# EAGLE schematic Maker Display2 (EAGLE 7.3.0)

## Sheet 1 of 5: Matrix Driver 1
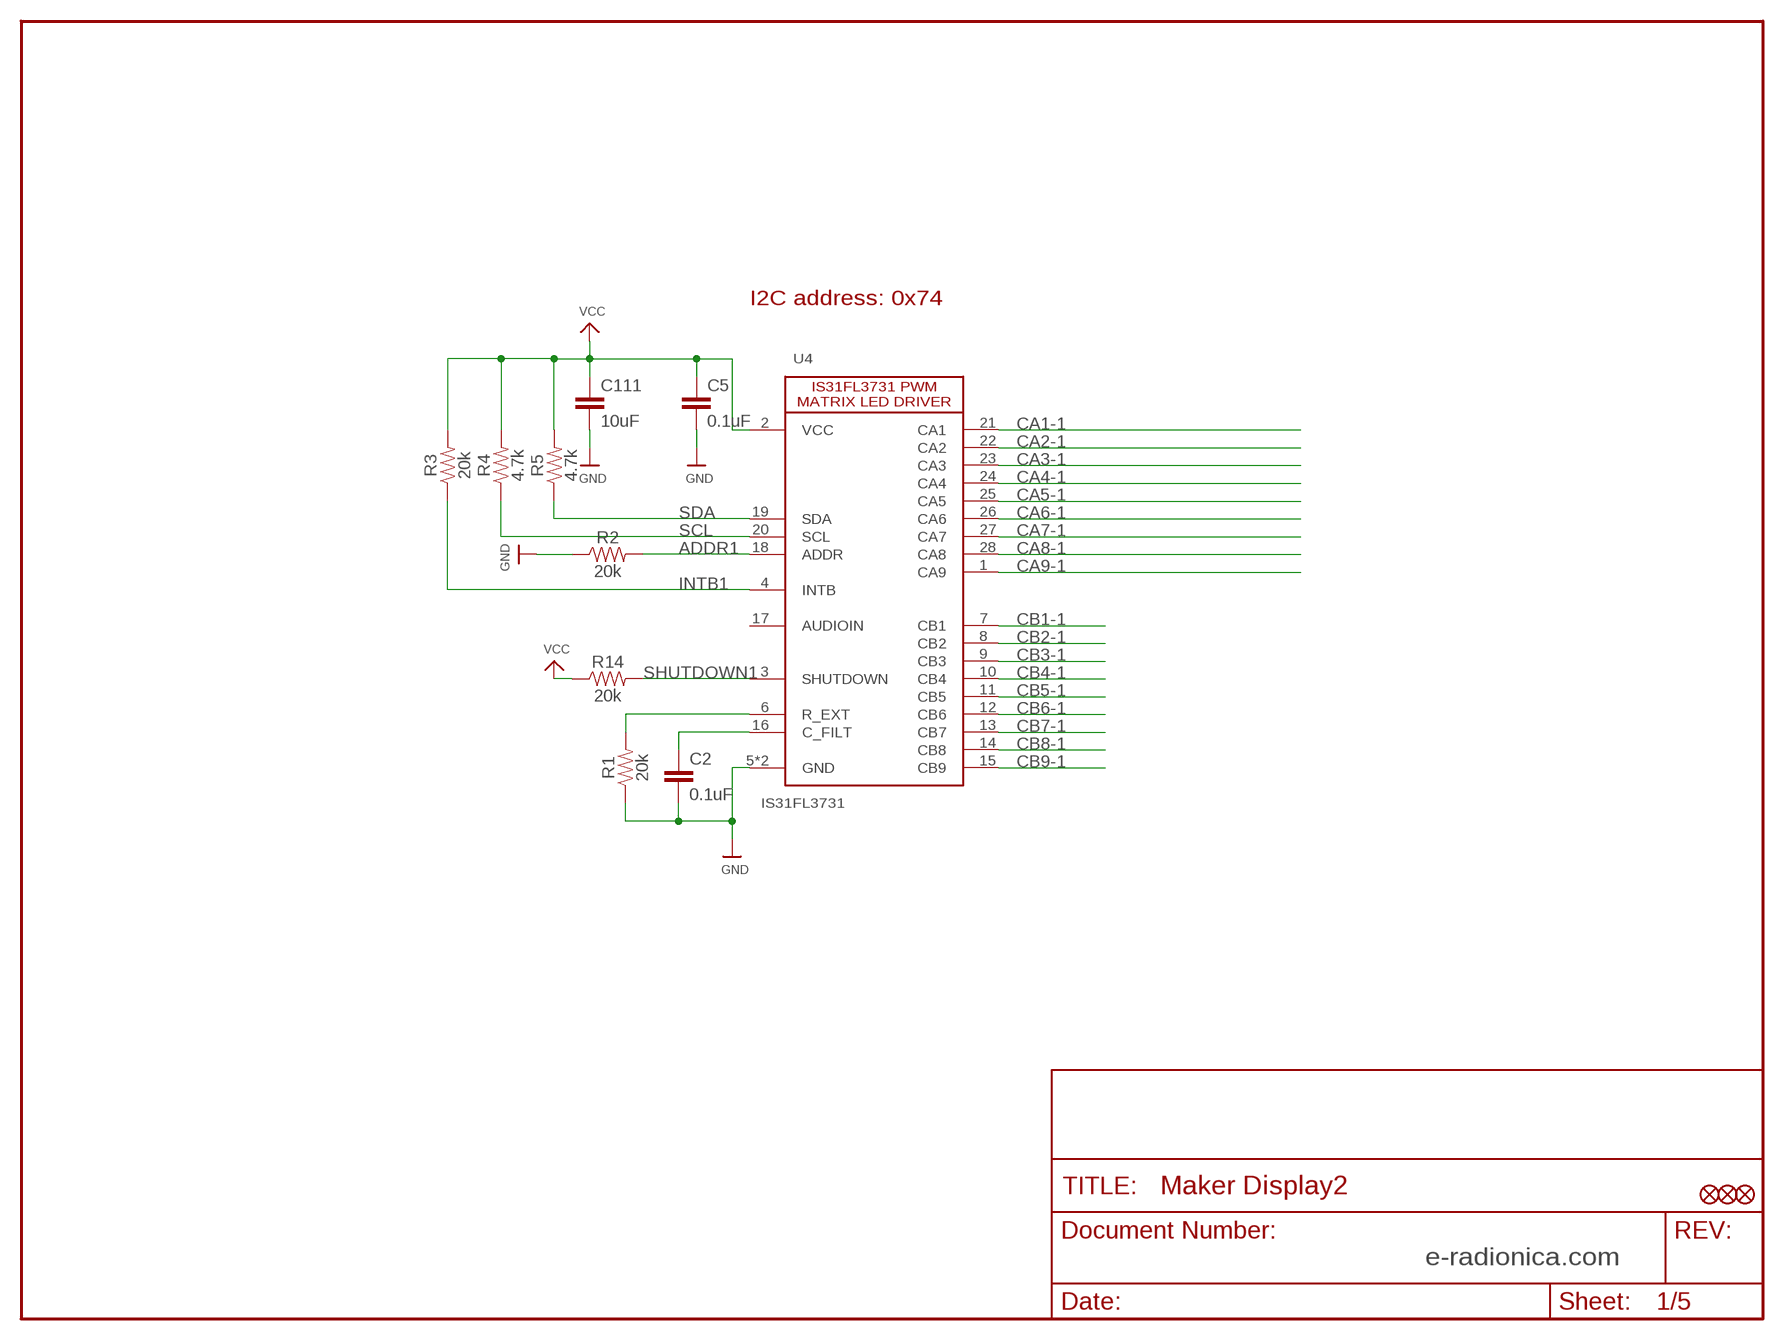
[diagram p0: schematic, sheet 1]

### Parts
C2  0.1uF  0.1UF-0603-25V-(+80/-20%)  [0603]
C5  0.1uF  0.1UF-0603-25V-(+80/-20%)  [0603]
C111  10uF  10UF-1206-6.3V-20%  [1206]
JP2  FIDUCIAL1X2  [FIDUCIAL-1X2]
JP3  FIDUCIAL1X2  [FIDUCIAL-1X2]
JP4  FIDUCIAL1X2  [FIDUCIAL-1X2]
R1  20k  20KOHM-0603-1/10W-1%  [0603]
R2  20k  20KOHM-0603-1/10W-1%  [0603]
R3  20k  20KOHM-0603-1/10W-1%  [0603]
R4  4.7k  4.7KOHM-0603-1/10W-1%  [0603]
R5  4.7k  4.7KOHM-0603-1/10W-1%  [0603]
R14  20k  20KOHM-0603-1/10W-1%  [0603]
U4  IS31FL3731  [QFN28]

### Nets
ADDR1: R2.2 U4.18(ADDR)
C-FILT: C2.1 U4.16(C_FILT)
CA1-1: U4.21(CA1) ; also sheet 2
CA2-1: U4.22(CA2) ; also sheet 2
CA3-1: U4.23(CA3) ; also sheet 2
CA4-1: U4.24(CA4) ; also sheet 2
CA5-1: U4.25(CA5) ; also sheet 2
CA6-1: U4.26(CA6) ; also sheet 2
CA7-1: U4.27(CA7) ; also sheet 2
CA8-1: U4.28(CA8) ; also sheet 2
CA9-1: U4.1(CA9) ; also sheet 2
CB1-1: U4.7(CB1) ; also sheet 2
CB2-1: U4.8(CB2) ; also sheet 2
CB3-1: U4.9(CB3) ; also sheet 2
CB4-1: U4.10(CB4) ; also sheet 2
CB5-1: U4.11(CB5) ; also sheet 2
CB6-1: U4.12(CB6) ; also sheet 2
CB7-1: U4.13(CB7) ; also sheet 2
CB8-1: U4.14(CB8) ; also sheet 2
CB9-1: U4.15(CB9) ; also sheet 2
GND: C2.2 C5.2 C111.2 R1.1 R2.1 U4.5(GND) U4.29_GND(GND) ; also sheet 3,5
INTB1: R3.1 U4.4(INTB)
R-EXT: R1.2 U4.6(R_EXT)
SCL: R4.1 U4.20(SCL) ; also sheet 3,5
SDA: R5.1 U4.19(SDA) ; also sheet 3,5
SHUTDOWN1: R14.2 U4.3(SHUTDOWN)
VCC: C5.1 C111.1 R3.2 R4.2 R5.2 R14.1 U4.2(VCC) ; also sheet 3,5
Unconnected: U4.17(AUDIOIN)

### Notes on the sheet
- I2C address: 0x74
- e-radionica.com

## Sheet 2 of 5: LED matrix 1
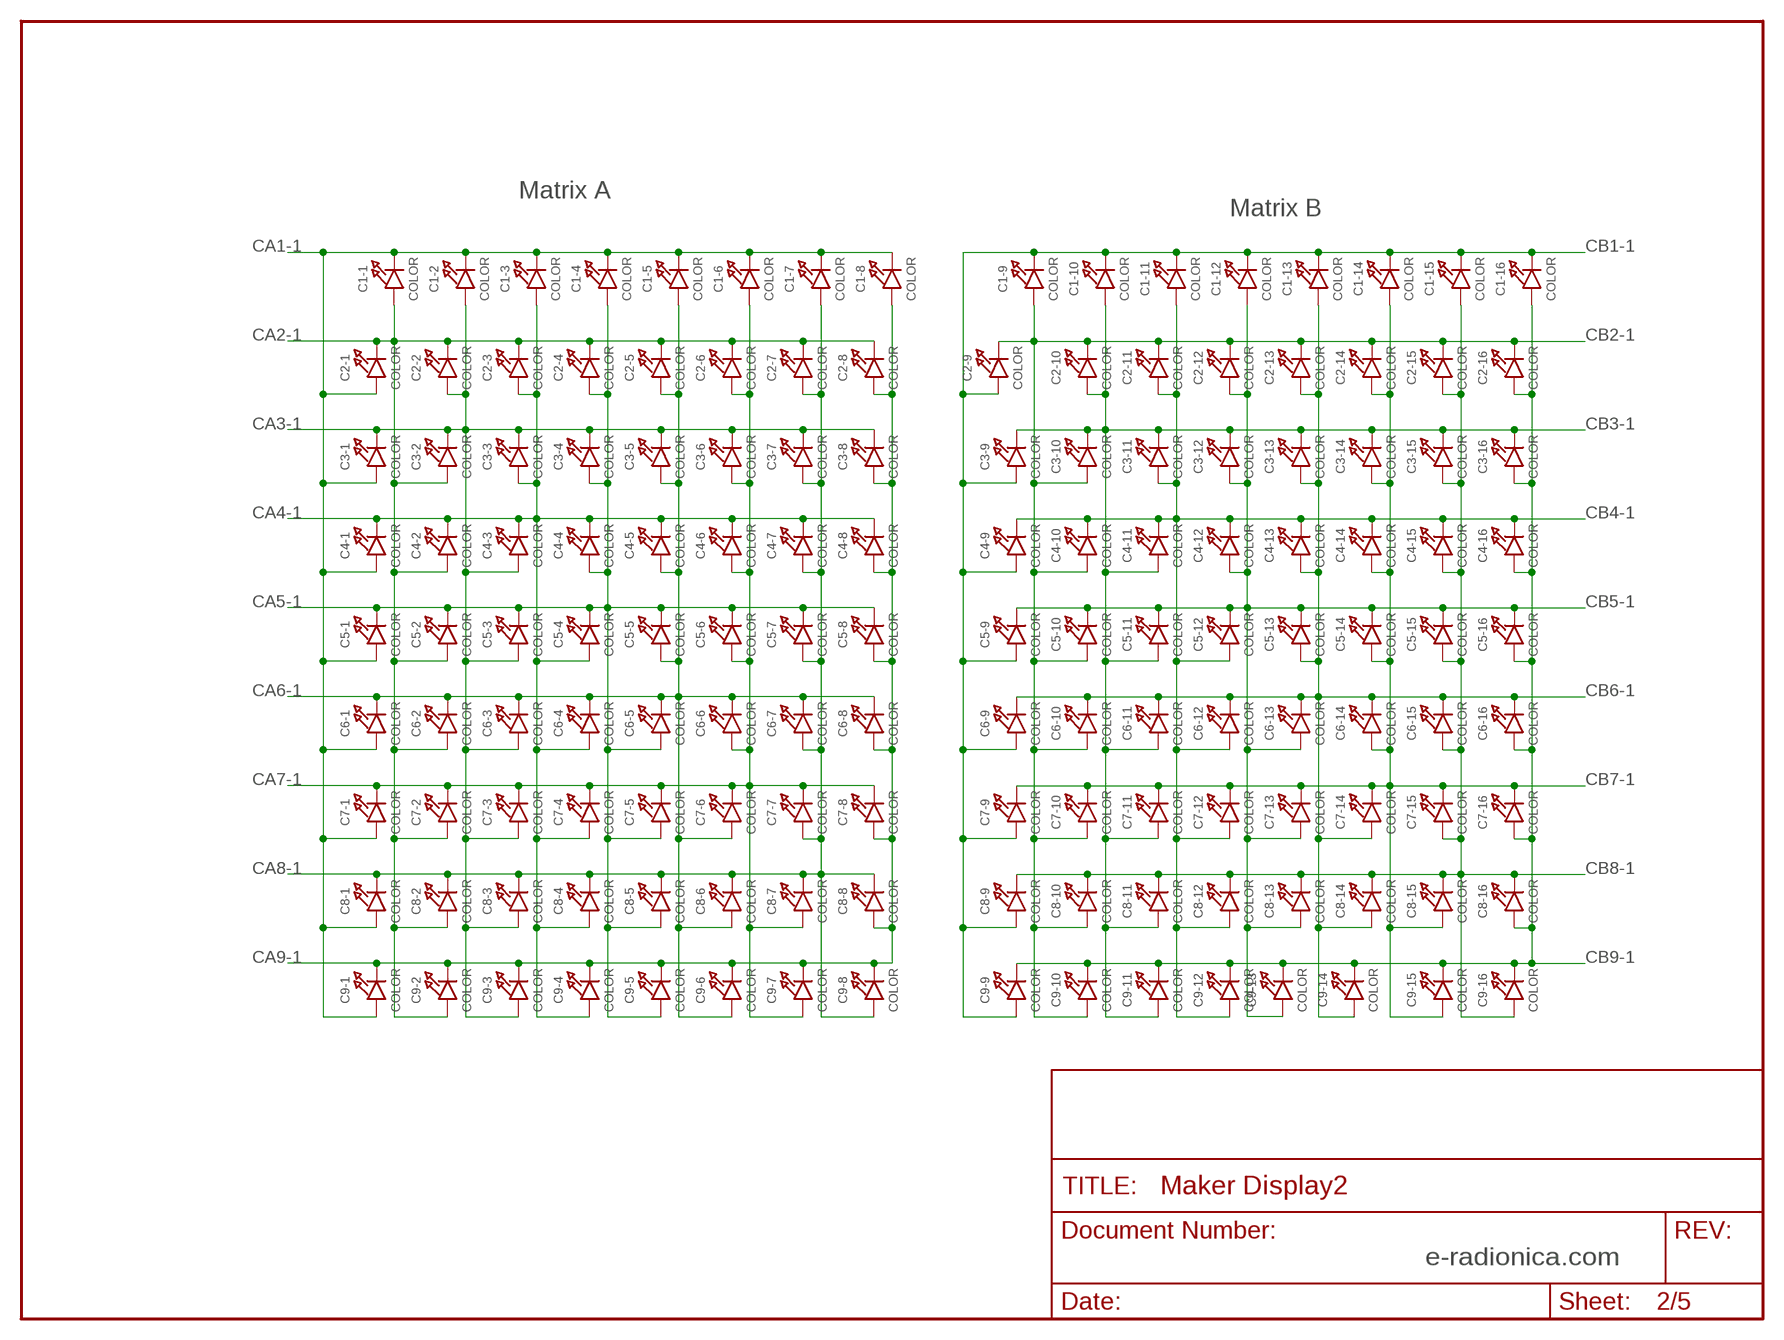
[diagram p1: schematic, sheet 2]

### Parts
C1-1  COLOR  LED0603_NOOUTLINE  [CHIPLED_0603_NOOUTLINE]
C1-2  COLOR  LED0603_NOOUTLINE  [CHIPLED_0603_NOOUTLINE]
C1-3  COLOR  LED0603_NOOUTLINE  [CHIPLED_0603_NOOUTLINE]
C1-4  COLOR  LED0603_NOOUTLINE  [CHIPLED_0603_NOOUTLINE]
C1-5  COLOR  LED0603_NOOUTLINE  [CHIPLED_0603_NOOUTLINE]
C1-6  COLOR  LED0603_NOOUTLINE  [CHIPLED_0603_NOOUTLINE]
C1-7  COLOR  LED0603_NOOUTLINE  [CHIPLED_0603_NOOUTLINE]
C1-8  COLOR  LED0603_NOOUTLINE  [CHIPLED_0603_NOOUTLINE]
C1-9  COLOR  LED0603_NOOUTLINE  [CHIPLED_0603_NOOUTLINE]
C1-10  COLOR  LED0603_NOOUTLINE  [CHIPLED_0603_NOOUTLINE]
C1-11  COLOR  LED0603_NOOUTLINE  [CHIPLED_0603_NOOUTLINE]
C1-12  COLOR  LED0603_NOOUTLINE  [CHIPLED_0603_NOOUTLINE]
C1-13  COLOR  LED0603_NOOUTLINE  [CHIPLED_0603_NOOUTLINE]
C1-14  COLOR  LED0603_NOOUTLINE  [CHIPLED_0603_NOOUTLINE]
C1-15  COLOR  LED0603_NOOUTLINE  [CHIPLED_0603_NOOUTLINE]
C1-16  COLOR  LED0603_NOOUTLINE  [CHIPLED_0603_NOOUTLINE]
C2-1  COLOR  LED0603_NOOUTLINE  [CHIPLED_0603_NOOUTLINE]
C2-2  COLOR  LED0603_NOOUTLINE  [CHIPLED_0603_NOOUTLINE]
C2-3  COLOR  LED0603_NOOUTLINE  [CHIPLED_0603_NOOUTLINE]
C2-4  COLOR  LED0603_NOOUTLINE  [CHIPLED_0603_NOOUTLINE]
C2-5  COLOR  LED0603_NOOUTLINE  [CHIPLED_0603_NOOUTLINE]
C2-6  COLOR  LED0603_NOOUTLINE  [CHIPLED_0603_NOOUTLINE]
C2-7  COLOR  LED0603_NOOUTLINE  [CHIPLED_0603_NOOUTLINE]
C2-8  COLOR  LED0603_NOOUTLINE  [CHIPLED_0603_NOOUTLINE]
C2-9  COLOR  LED0603_NOOUTLINE  [CHIPLED_0603_NOOUTLINE]
C2-10  COLOR  LED0603_NOOUTLINE  [CHIPLED_0603_NOOUTLINE]
C2-11  COLOR  LED0603_NOOUTLINE  [CHIPLED_0603_NOOUTLINE]
C2-12  COLOR  LED0603_NOOUTLINE  [CHIPLED_0603_NOOUTLINE]
C2-13  COLOR  LED0603_NOOUTLINE  [CHIPLED_0603_NOOUTLINE]
C2-14  COLOR  LED0603_NOOUTLINE  [CHIPLED_0603_NOOUTLINE]
C2-15  COLOR  LED0603_NOOUTLINE  [CHIPLED_0603_NOOUTLINE]
C2-16  COLOR  LED0603_NOOUTLINE  [CHIPLED_0603_NOOUTLINE]
C3-1  COLOR  LED0603_NOOUTLINE  [CHIPLED_0603_NOOUTLINE]
C3-2  COLOR  LED0603_NOOUTLINE  [CHIPLED_0603_NOOUTLINE]
C3-3  COLOR  LED0603_NOOUTLINE  [CHIPLED_0603_NOOUTLINE]
C3-4  COLOR  LED0603_NOOUTLINE  [CHIPLED_0603_NOOUTLINE]
C3-5  COLOR  LED0603_NOOUTLINE  [CHIPLED_0603_NOOUTLINE]
C3-6  COLOR  LED0603_NOOUTLINE  [CHIPLED_0603_NOOUTLINE]
C3-7  COLOR  LED0603_NOOUTLINE  [CHIPLED_0603_NOOUTLINE]
C3-8  COLOR  LED0603_NOOUTLINE  [CHIPLED_0603_NOOUTLINE]
C3-9  COLOR  LED0603_NOOUTLINE  [CHIPLED_0603_NOOUTLINE]
C3-10  COLOR  LED0603_NOOUTLINE  [CHIPLED_0603_NOOUTLINE]
C3-11  COLOR  LED0603_NOOUTLINE  [CHIPLED_0603_NOOUTLINE]
C3-12  COLOR  LED0603_NOOUTLINE  [CHIPLED_0603_NOOUTLINE]
C3-13  COLOR  LED0603_NOOUTLINE  [CHIPLED_0603_NOOUTLINE]
C3-14  COLOR  LED0603_NOOUTLINE  [CHIPLED_0603_NOOUTLINE]
C3-15  COLOR  LED0603_NOOUTLINE  [CHIPLED_0603_NOOUTLINE]
C3-16  COLOR  LED0603_NOOUTLINE  [CHIPLED_0603_NOOUTLINE]
C4-1  COLOR  LED0603_NOOUTLINE  [CHIPLED_0603_NOOUTLINE]
C4-2  COLOR  LED0603_NOOUTLINE  [CHIPLED_0603_NOOUTLINE]
C4-3  COLOR  LED0603_NOOUTLINE  [CHIPLED_0603_NOOUTLINE]
C4-4  COLOR  LED0603_NOOUTLINE  [CHIPLED_0603_NOOUTLINE]
C4-5  COLOR  LED0603_NOOUTLINE  [CHIPLED_0603_NOOUTLINE]
C4-6  COLOR  LED0603_NOOUTLINE  [CHIPLED_0603_NOOUTLINE]
C4-7  COLOR  LED0603_NOOUTLINE  [CHIPLED_0603_NOOUTLINE]
C4-8  COLOR  LED0603_NOOUTLINE  [CHIPLED_0603_NOOUTLINE]
C4-9  COLOR  LED0603_NOOUTLINE  [CHIPLED_0603_NOOUTLINE]
C4-10  COLOR  LED0603_NOOUTLINE  [CHIPLED_0603_NOOUTLINE]
C4-11  COLOR  LED0603_NOOUTLINE  [CHIPLED_0603_NOOUTLINE]
C4-12  COLOR  LED0603_NOOUTLINE  [CHIPLED_0603_NOOUTLINE]
C4-13  COLOR  LED0603_NOOUTLINE  [CHIPLED_0603_NOOUTLINE]
C4-14  COLOR  LED0603_NOOUTLINE  [CHIPLED_0603_NOOUTLINE]
C4-15  COLOR  LED0603_NOOUTLINE  [CHIPLED_0603_NOOUTLINE]
C4-16  COLOR  LED0603_NOOUTLINE  [CHIPLED_0603_NOOUTLINE]
C5-1  COLOR  LED0603_NOOUTLINE  [CHIPLED_0603_NOOUTLINE]
C5-2  COLOR  LED0603_NOOUTLINE  [CHIPLED_0603_NOOUTLINE]
C5-3  COLOR  LED0603_NOOUTLINE  [CHIPLED_0603_NOOUTLINE]
C5-4  COLOR  LED0603_NOOUTLINE  [CHIPLED_0603_NOOUTLINE]
C5-5  COLOR  LED0603_NOOUTLINE  [CHIPLED_0603_NOOUTLINE]
C5-6  COLOR  LED0603_NOOUTLINE  [CHIPLED_0603_NOOUTLINE]
C5-7  COLOR  LED0603_NOOUTLINE  [CHIPLED_0603_NOOUTLINE]
C5-8  COLOR  LED0603_NOOUTLINE  [CHIPLED_0603_NOOUTLINE]
C5-9  COLOR  LED0603_NOOUTLINE  [CHIPLED_0603_NOOUTLINE]
C5-10  COLOR  LED0603_NOOUTLINE  [CHIPLED_0603_NOOUTLINE]
C5-11  COLOR  LED0603_NOOUTLINE  [CHIPLED_0603_NOOUTLINE]
C5-12  COLOR  LED0603_NOOUTLINE  [CHIPLED_0603_NOOUTLINE]
C5-13  COLOR  LED0603_NOOUTLINE  [CHIPLED_0603_NOOUTLINE]
C5-14  COLOR  LED0603_NOOUTLINE  [CHIPLED_0603_NOOUTLINE]
C5-15  COLOR  LED0603_NOOUTLINE  [CHIPLED_0603_NOOUTLINE]
C5-16  COLOR  LED0603_NOOUTLINE  [CHIPLED_0603_NOOUTLINE]
C6-1  COLOR  LED0603_NOOUTLINE  [CHIPLED_0603_NOOUTLINE]
C6-2  COLOR  LED0603_NOOUTLINE  [CHIPLED_0603_NOOUTLINE]
C6-3  COLOR  LED0603_NOOUTLINE  [CHIPLED_0603_NOOUTLINE]
C6-4  COLOR  LED0603_NOOUTLINE  [CHIPLED_0603_NOOUTLINE]
C6-5  COLOR  LED0603_NOOUTLINE  [CHIPLED_0603_NOOUTLINE]
C6-6  COLOR  LED0603_NOOUTLINE  [CHIPLED_0603_NOOUTLINE]
C6-7  COLOR  LED0603_NOOUTLINE  [CHIPLED_0603_NOOUTLINE]
C6-8  COLOR  LED0603_NOOUTLINE  [CHIPLED_0603_NOOUTLINE]
C6-9  COLOR  LED0603_NOOUTLINE  [CHIPLED_0603_NOOUTLINE]
C6-10  COLOR  LED0603_NOOUTLINE  [CHIPLED_0603_NOOUTLINE]
C6-11  COLOR  LED0603_NOOUTLINE  [CHIPLED_0603_NOOUTLINE]
C6-12  COLOR  LED0603_NOOUTLINE  [CHIPLED_0603_NOOUTLINE]
C6-13  COLOR  LED0603_NOOUTLINE  [CHIPLED_0603_NOOUTLINE]
C6-14  COLOR  LED0603_NOOUTLINE  [CHIPLED_0603_NOOUTLINE]
C6-15  COLOR  LED0603_NOOUTLINE  [CHIPLED_0603_NOOUTLINE]
C6-16  COLOR  LED0603_NOOUTLINE  [CHIPLED_0603_NOOUTLINE]
C7-1  COLOR  LED0603_NOOUTLINE  [CHIPLED_0603_NOOUTLINE]
C7-2  COLOR  LED0603_NOOUTLINE  [CHIPLED_0603_NOOUTLINE]
C7-3  COLOR  LED0603_NOOUTLINE  [CHIPLED_0603_NOOUTLINE]
C7-4  COLOR  LED0603_NOOUTLINE  [CHIPLED_0603_NOOUTLINE]
C7-5  COLOR  LED0603_NOOUTLINE  [CHIPLED_0603_NOOUTLINE]
C7-6  COLOR  LED0603_NOOUTLINE  [CHIPLED_0603_NOOUTLINE]
C7-7  COLOR  LED0603_NOOUTLINE  [CHIPLED_0603_NOOUTLINE]
C7-8  COLOR  LED0603_NOOUTLINE  [CHIPLED_0603_NOOUTLINE]
C7-9  COLOR  LED0603_NOOUTLINE  [CHIPLED_0603_NOOUTLINE]
C7-10  COLOR  LED0603_NOOUTLINE  [CHIPLED_0603_NOOUTLINE]
C7-11  COLOR  LED0603_NOOUTLINE  [CHIPLED_0603_NOOUTLINE]
C7-12  COLOR  LED0603_NOOUTLINE  [CHIPLED_0603_NOOUTLINE]
C7-13  COLOR  LED0603_NOOUTLINE  [CHIPLED_0603_NOOUTLINE]
C7-14  COLOR  LED0603_NOOUTLINE  [CHIPLED_0603_NOOUTLINE]
C7-15  COLOR  LED0603_NOOUTLINE  [CHIPLED_0603_NOOUTLINE]
C7-16  COLOR  LED0603_NOOUTLINE  [CHIPLED_0603_NOOUTLINE]
C8-1  COLOR  LED0603_NOOUTLINE  [CHIPLED_0603_NOOUTLINE]
C8-2  COLOR  LED0603_NOOUTLINE  [CHIPLED_0603_NOOUTLINE]
C8-3  COLOR  LED0603_NOOUTLINE  [CHIPLED_0603_NOOUTLINE]
C8-4  COLOR  LED0603_NOOUTLINE  [CHIPLED_0603_NOOUTLINE]
C8-5  COLOR  LED0603_NOOUTLINE  [CHIPLED_0603_NOOUTLINE]
C8-6  COLOR  LED0603_NOOUTLINE  [CHIPLED_0603_NOOUTLINE]
C8-7  COLOR  LED0603_NOOUTLINE  [CHIPLED_0603_NOOUTLINE]
C8-8  COLOR  LED0603_NOOUTLINE  [CHIPLED_0603_NOOUTLINE]
C8-9  COLOR  LED0603_NOOUTLINE  [CHIPLED_0603_NOOUTLINE]
C8-10  COLOR  LED0603_NOOUTLINE  [CHIPLED_0603_NOOUTLINE]
C8-11  COLOR  LED0603_NOOUTLINE  [CHIPLED_0603_NOOUTLINE]
C8-12  COLOR  LED0603_NOOUTLINE  [CHIPLED_0603_NOOUTLINE]
C8-13  COLOR  LED0603_NOOUTLINE  [CHIPLED_0603_NOOUTLINE]
C8-14  COLOR  LED0603_NOOUTLINE  [CHIPLED_0603_NOOUTLINE]
C8-15  COLOR  LED0603_NOOUTLINE  [CHIPLED_0603_NOOUTLINE]
C8-16  COLOR  LED0603_NOOUTLINE  [CHIPLED_0603_NOOUTLINE]
C9-1  COLOR  LED0603_NOOUTLINE  [CHIPLED_0603_NOOUTLINE]
C9-2  COLOR  LED0603_NOOUTLINE  [CHIPLED_0603_NOOUTLINE]
C9-3  COLOR  LED0603_NOOUTLINE  [CHIPLED_0603_NOOUTLINE]
C9-4  COLOR  LED0603_NOOUTLINE  [CHIPLED_0603_NOOUTLINE]
C9-5  COLOR  LED0603_NOOUTLINE  [CHIPLED_0603_NOOUTLINE]
C9-6  COLOR  LED0603_NOOUTLINE  [CHIPLED_0603_NOOUTLINE]
C9-7  COLOR  LED0603_NOOUTLINE  [CHIPLED_0603_NOOUTLINE]
C9-8  COLOR  LED0603_NOOUTLINE  [CHIPLED_0603_NOOUTLINE]
C9-9  COLOR  LED0603_NOOUTLINE  [CHIPLED_0603_NOOUTLINE]
C9-10  COLOR  LED0603_NOOUTLINE  [CHIPLED_0603_NOOUTLINE]
C9-11  COLOR  LED0603_NOOUTLINE  [CHIPLED_0603_NOOUTLINE]
C9-12  COLOR  LED0603_NOOUTLINE  [CHIPLED_0603_NOOUTLINE]
C9-13  COLOR  LED0603_NOOUTLINE  [CHIPLED_0603_NOOUTLINE]
C9-14  COLOR  LED0603_NOOUTLINE  [CHIPLED_0603_NOOUTLINE]
C9-15  COLOR  LED0603_NOOUTLINE  [CHIPLED_0603_NOOUTLINE]
C9-16  COLOR  LED0603_NOOUTLINE  [CHIPLED_0603_NOOUTLINE]

### Nets
CA1-1: C1-1.C C1-2.C C1-3.C C1-4.C C1-5.C C1-6.C C1-7.C C1-8.C C2-1.A C3-1.A C4-1.A C5-1.A C6-1.A C7-1.A C8-1.A C9-1.A ; also sheet 1
CA2-1: C1-1.A C2-1.C C2-2.C C2-3.C C2-4.C C2-5.C C2-6.C C2-7.C C2-8.C C3-2.A C4-2.A C5-2.A C6-2.A C7-2.A C8-2.A C9-2.A ; also sheet 1
CA3-1: C1-2.A C2-2.A C3-1.C C3-2.C C3-3.C C3-4.C C3-5.C C3-6.C C3-7.C C3-8.C C4-3.A C5-3.A C6-3.A C7-3.A C8-3.A C9-3.A ; also sheet 1
CA4-1: C1-3.A C2-3.A C3-3.A C4-1.C C4-2.C C4-3.C C4-4.C C4-5.C C4-6.C C4-7.C C4-8.C C5-4.A C6-4.A C7-4.A C8-4.A C9-4.A ; also sheet 1
CA5-1: C1-4.A C2-4.A C3-4.A C4-4.A C5-1.C C5-2.C C5-3.C C5-4.C C5-5.C C5-6.C C5-7.C C5-8.C C6-5.A C7-5.A C8-5.A C9-5.A ; also sheet 1
CA6-1: C1-5.A C2-5.A C3-5.A C4-5.A C5-5.A C6-1.C C6-2.C C6-3.C C6-4.C C6-5.C C6-6.C C6-7.C C6-8.C C7-6.A C8-6.A C9-6.A ; also sheet 1
CA7-1: C1-6.A C2-6.A C3-6.A C4-6.A C5-6.A C6-6.A C7-1.C C7-2.C C7-3.C C7-4.C C7-5.C C7-6.C C7-7.C C7-8.C C8-7.A C9-7.A ; also sheet 1
CA8-1: C1-7.A C2-7.A C3-7.A C4-7.A C5-7.A C6-7.A C7-7.A C8-1.C C8-2.C C8-3.C C8-4.C C8-5.C C8-6.C C8-7.C C8-8.C C9-8.A ; also sheet 1
CA9-1: C1-8.A C2-8.A C3-8.A C4-8.A C5-8.A C6-8.A C7-8.A C8-8.A C9-1.C C9-2.C C9-3.C C9-4.C C9-5.C C9-6.C C9-7.C C9-8.C ; also sheet 1
CB1-1: C1-9.C C1-10.C C1-11.C C1-12.C C1-13.C C1-14.C C1-15.C C1-16.C C2-9.A C3-9.A C4-9.A C5-9.A C6-9.A C7-9.A C8-9.A C9-9.A ; also sheet 1
CB2-1: C1-9.A C2-9.C C2-10.C C2-11.C C2-12.C C2-13.C C2-14.C C2-15.C C2-16.C C3-10.A C4-10.A C5-10.A C6-10.A C7-10.A C8-10.A C9-10.A ; also sheet 1
CB3-1: C1-10.A C2-10.A C3-9.C C3-10.C C3-11.C C3-12.C C3-13.C C3-14.C C3-15.C C3-16.C C4-11.A C5-11.A C6-11.A C7-11.A C8-11.A C9-11.A ; also sheet 1
CB4-1: C1-11.A C2-11.A C3-11.A C4-9.C C4-10.C C4-11.C C4-12.C C4-13.C C4-14.C C4-15.C C4-16.C C5-12.A C6-12.A C7-12.A C8-12.A C9-12.A ; also sheet 1
CB5-1: C1-12.A C2-12.A C3-12.A C4-12.A C5-9.C C5-10.C C5-11.C C5-12.C C5-13.C C5-14.C C5-15.C C5-16.C C6-13.A C7-13.A C8-13.A C9-13.A ; also sheet 1
CB6-1: C1-13.A C2-13.A C3-13.A C4-13.A C5-13.A C6-9.C C6-10.C C6-11.C C6-12.C C6-13.C C6-14.C C6-15.C C6-16.C C7-14.A C8-14.A C9-14.A ; also sheet 1
CB7-1: C1-14.A C2-14.A C3-14.A C4-14.A C5-14.A C6-14.A C7-9.C C7-10.C C7-11.C C7-12.C C7-13.C C7-14.C C7-15.C C7-16.C C8-15.A C9-15.A ; also sheet 1
CB8-1: C1-15.A C2-15.A C3-15.A C4-15.A C5-15.A C6-15.A C7-15.A C8-9.C C8-10.C C8-11.C C8-12.C C8-13.C C8-14.C C8-15.C C8-16.C C9-16.A ; also sheet 1
CB9-1: C1-16.A C2-16.A C3-16.A C4-16.A C5-16.A C6-16.A C7-16.A C8-16.A C9-9.C C9-10.C C9-11.C C9-12.C C9-13.C C9-14.C C9-15.C C9-16.C ; also sheet 1

### Notes on the sheet
- Matrix A
- Matrix B
- e-radionica.com

## Sheet 3 of 5: Matrix Driver 2
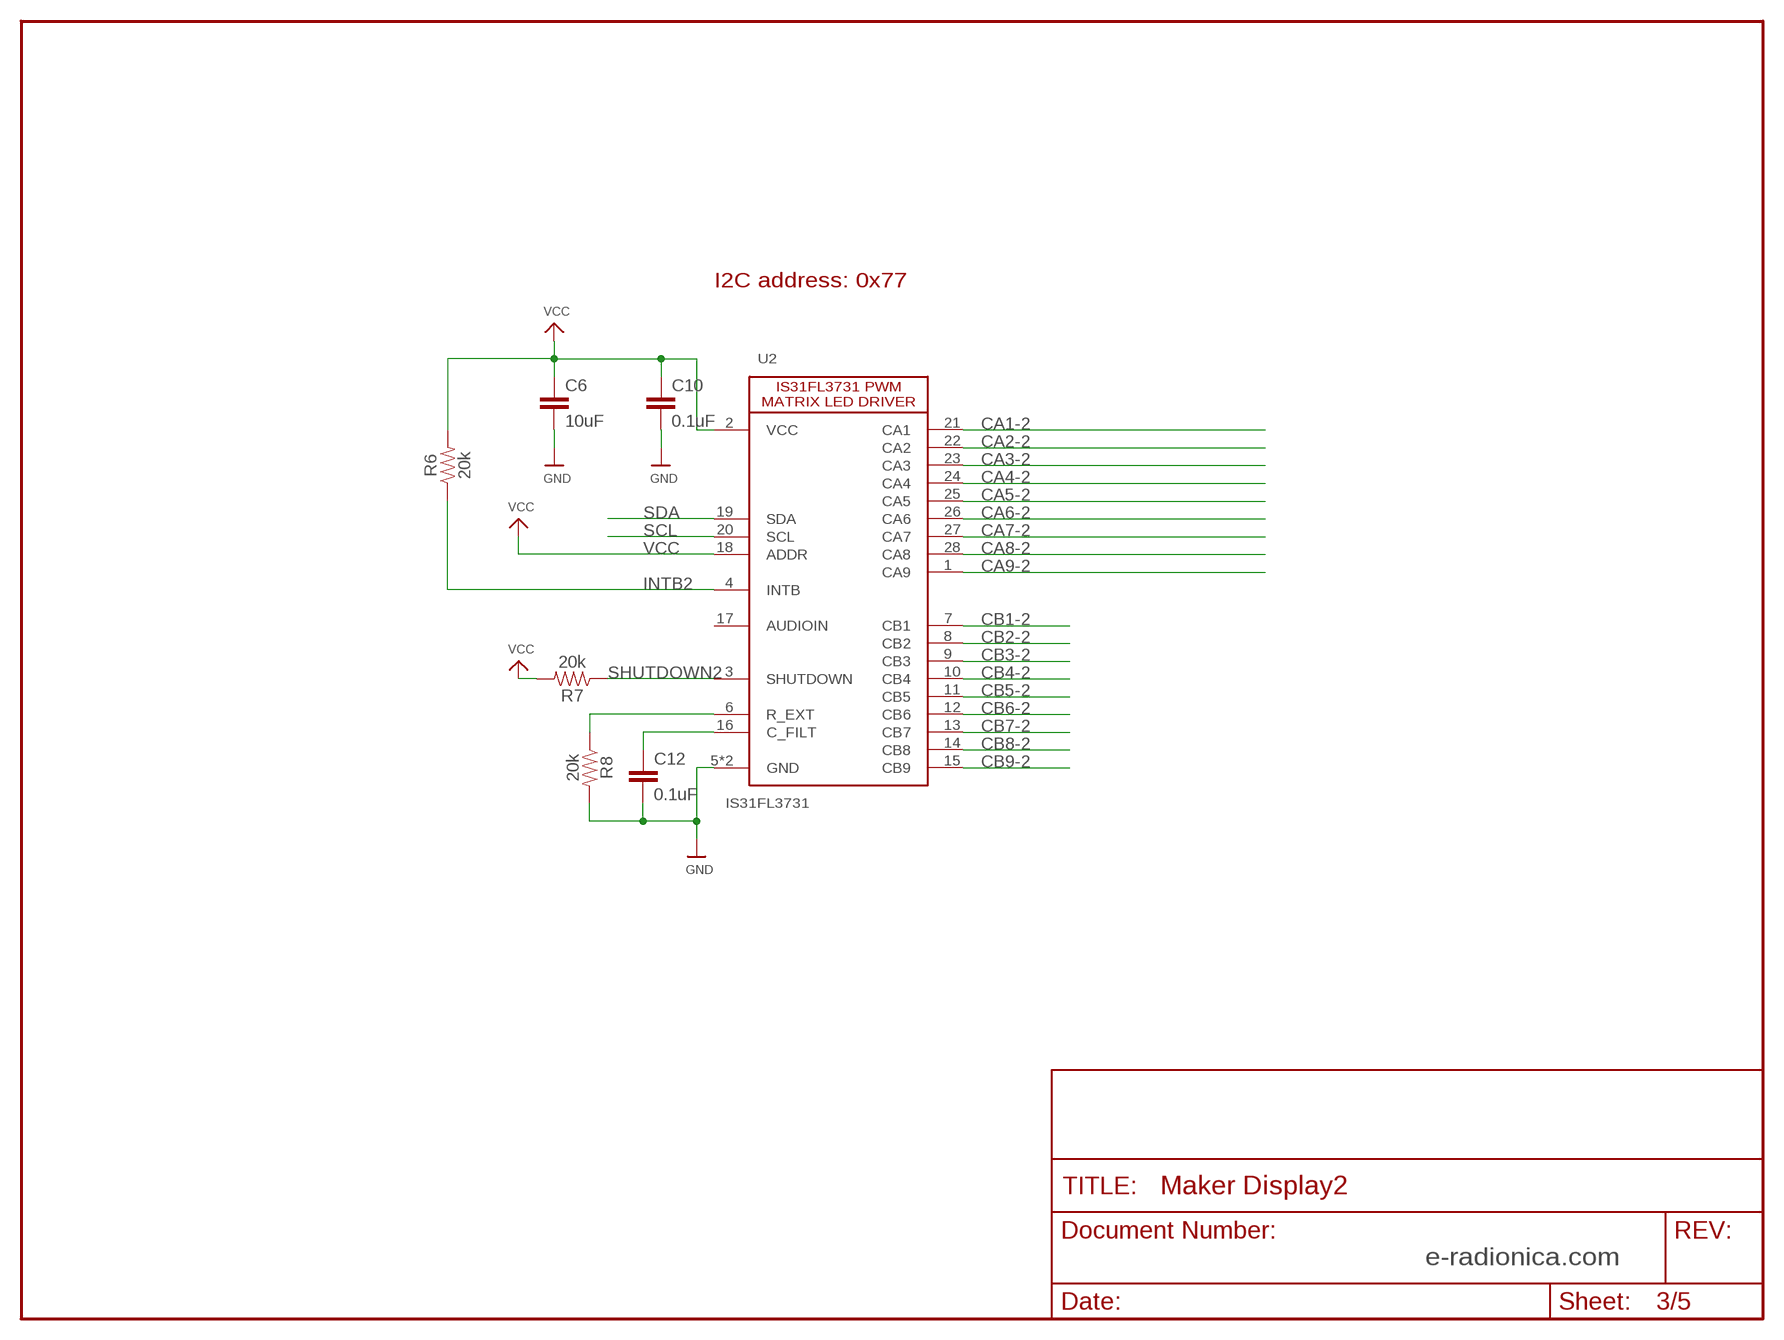
[diagram p2: schematic, sheet 3]

### Parts
C6  10uF  10UF-1206-6.3V-20%  [1206]
C10  0.1uF  0.1UF-0603-25V-(+80/-20%)  [0603]
C12  0.1uF  0.1UF-0603-25V-(+80/-20%)  [0603]
R6  20k  20KOHM-0603-1/10W-1%  [0603]
R7  20k  20KOHM-0603-1/10W-1%  [0603]
R8  20k  20KOHM-0603-1/10W-1%  [0603]
U2  IS31FL3731  [QFN28]

### Nets
CA1-2: U2.21(CA1) ; also sheet 4
CA2-2: U2.22(CA2) ; also sheet 4
CA3-2: U2.23(CA3) ; also sheet 4
CA4-2: U2.24(CA4) ; also sheet 4
CA5-2: U2.25(CA5) ; also sheet 4
CA6-2: U2.26(CA6) ; also sheet 4
CA7-2: U2.27(CA7) ; also sheet 4
CA8-2: U2.28(CA8) ; also sheet 4
CA9-2: U2.1(CA9) ; also sheet 4
CB1-2: U2.7(CB1) ; also sheet 4
CB2-2: U2.8(CB2) ; also sheet 4
CB3-2: U2.9(CB3) ; also sheet 4
CB4-2: U2.10(CB4) ; also sheet 4
CB5-2: U2.11(CB5) ; also sheet 4
CB6-2: U2.12(CB6) ; also sheet 4
CB7-2: U2.13(CB7) ; also sheet 4
CB8-2: U2.14(CB8) ; also sheet 4
CB9-2: U2.15(CB9) ; also sheet 4
GND: C6.2 C10.2 C12.2 R8.2 U2.5(GND) U2.29_GND(GND) ; also sheet 1,5
INTB2: R6.1 U2.4(INTB)
N$4: C12.1 U2.16(C_FILT)
N$5: R8.1 U2.6(R_EXT)
SCL: U2.20(SCL) ; also sheet 1,5
SDA: U2.19(SDA) ; also sheet 1,5
SHUTDOWN2: R7.1 U2.3(SHUTDOWN)
VCC: C6.1 C10.1 R6.2 R7.2 U2.2(VCC) U2.18(ADDR) ; also sheet 1,5
Unconnected: U2.17(AUDIOIN)

### Notes on the sheet
- I2C address: 0x77
- e-radionica.com

## Sheet 4 of 5: LED Matrix 2
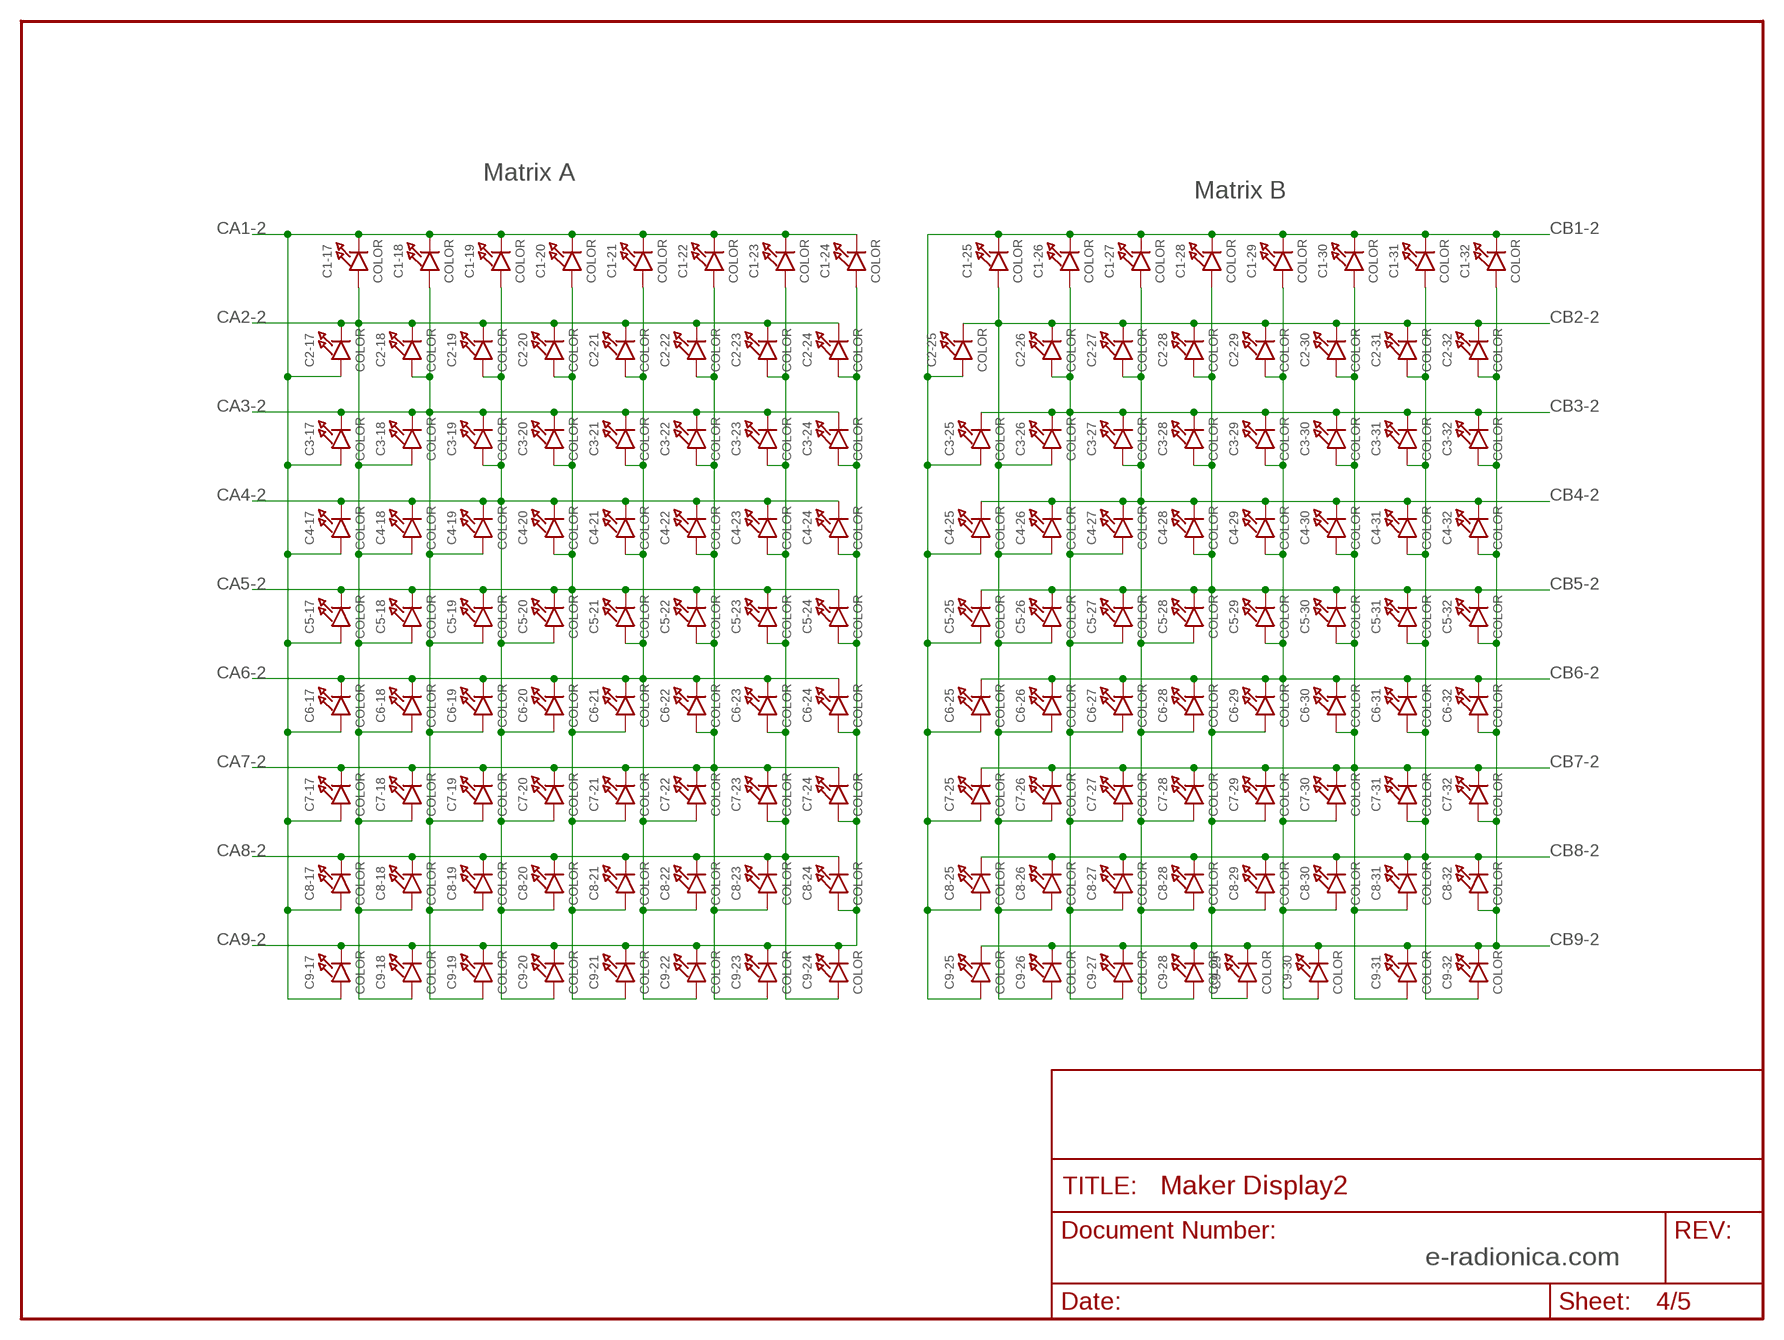
[diagram p3: schematic, sheet 4]

### Parts
C1-17  COLOR  LED0603_NOOUTLINE  [CHIPLED_0603_NOOUTLINE]
C1-18  COLOR  LED0603_NOOUTLINE  [CHIPLED_0603_NOOUTLINE]
C1-19  COLOR  LED0603_NOOUTLINE  [CHIPLED_0603_NOOUTLINE]
C1-20  COLOR  LED0603_NOOUTLINE  [CHIPLED_0603_NOOUTLINE]
C1-21  COLOR  LED0603_NOOUTLINE  [CHIPLED_0603_NOOUTLINE]
C1-22  COLOR  LED0603_NOOUTLINE  [CHIPLED_0603_NOOUTLINE]
C1-23  COLOR  LED0603_NOOUTLINE  [CHIPLED_0603_NOOUTLINE]
C1-24  COLOR  LED0603_NOOUTLINE  [CHIPLED_0603_NOOUTLINE]
C1-25  COLOR  LED0603_NOOUTLINE  [CHIPLED_0603_NOOUTLINE]
C1-26  COLOR  LED0603_NOOUTLINE  [CHIPLED_0603_NOOUTLINE]
C1-27  COLOR  LED0603_NOOUTLINE  [CHIPLED_0603_NOOUTLINE]
C1-28  COLOR  LED0603_NOOUTLINE  [CHIPLED_0603_NOOUTLINE]
C1-29  COLOR  LED0603_NOOUTLINE  [CHIPLED_0603_NOOUTLINE]
C1-30  COLOR  LED0603_NOOUTLINE  [CHIPLED_0603_NOOUTLINE]
C1-31  COLOR  LED0603_NOOUTLINE  [CHIPLED_0603_NOOUTLINE]
C1-32  COLOR  LED0603_NOOUTLINE  [CHIPLED_0603_NOOUTLINE]
C2-17  COLOR  LED0603_NOOUTLINE  [CHIPLED_0603_NOOUTLINE]
C2-18  COLOR  LED0603_NOOUTLINE  [CHIPLED_0603_NOOUTLINE]
C2-19  COLOR  LED0603_NOOUTLINE  [CHIPLED_0603_NOOUTLINE]
C2-20  COLOR  LED0603_NOOUTLINE  [CHIPLED_0603_NOOUTLINE]
C2-21  COLOR  LED0603_NOOUTLINE  [CHIPLED_0603_NOOUTLINE]
C2-22  COLOR  LED0603_NOOUTLINE  [CHIPLED_0603_NOOUTLINE]
C2-23  COLOR  LED0603_NOOUTLINE  [CHIPLED_0603_NOOUTLINE]
C2-24  COLOR  LED0603_NOOUTLINE  [CHIPLED_0603_NOOUTLINE]
C2-25  COLOR  LED0603_NOOUTLINE  [CHIPLED_0603_NOOUTLINE]
C2-26  COLOR  LED0603_NOOUTLINE  [CHIPLED_0603_NOOUTLINE]
C2-27  COLOR  LED0603_NOOUTLINE  [CHIPLED_0603_NOOUTLINE]
C2-28  COLOR  LED0603_NOOUTLINE  [CHIPLED_0603_NOOUTLINE]
C2-29  COLOR  LED0603_NOOUTLINE  [CHIPLED_0603_NOOUTLINE]
C2-30  COLOR  LED0603_NOOUTLINE  [CHIPLED_0603_NOOUTLINE]
C2-31  COLOR  LED0603_NOOUTLINE  [CHIPLED_0603_NOOUTLINE]
C2-32  COLOR  LED0603_NOOUTLINE  [CHIPLED_0603_NOOUTLINE]
C3-17  COLOR  LED0603_NOOUTLINE  [CHIPLED_0603_NOOUTLINE]
C3-18  COLOR  LED0603_NOOUTLINE  [CHIPLED_0603_NOOUTLINE]
C3-19  COLOR  LED0603_NOOUTLINE  [CHIPLED_0603_NOOUTLINE]
C3-20  COLOR  LED0603_NOOUTLINE  [CHIPLED_0603_NOOUTLINE]
C3-21  COLOR  LED0603_NOOUTLINE  [CHIPLED_0603_NOOUTLINE]
C3-22  COLOR  LED0603_NOOUTLINE  [CHIPLED_0603_NOOUTLINE]
C3-23  COLOR  LED0603_NOOUTLINE  [CHIPLED_0603_NOOUTLINE]
C3-24  COLOR  LED0603_NOOUTLINE  [CHIPLED_0603_NOOUTLINE]
C3-25  COLOR  LED0603_NOOUTLINE  [CHIPLED_0603_NOOUTLINE]
C3-26  COLOR  LED0603_NOOUTLINE  [CHIPLED_0603_NOOUTLINE]
C3-27  COLOR  LED0603_NOOUTLINE  [CHIPLED_0603_NOOUTLINE]
C3-28  COLOR  LED0603_NOOUTLINE  [CHIPLED_0603_NOOUTLINE]
C3-29  COLOR  LED0603_NOOUTLINE  [CHIPLED_0603_NOOUTLINE]
C3-30  COLOR  LED0603_NOOUTLINE  [CHIPLED_0603_NOOUTLINE]
C3-31  COLOR  LED0603_NOOUTLINE  [CHIPLED_0603_NOOUTLINE]
C3-32  COLOR  LED0603_NOOUTLINE  [CHIPLED_0603_NOOUTLINE]
C4-17  COLOR  LED0603_NOOUTLINE  [CHIPLED_0603_NOOUTLINE]
C4-18  COLOR  LED0603_NOOUTLINE  [CHIPLED_0603_NOOUTLINE]
C4-19  COLOR  LED0603_NOOUTLINE  [CHIPLED_0603_NOOUTLINE]
C4-20  COLOR  LED0603_NOOUTLINE  [CHIPLED_0603_NOOUTLINE]
C4-21  COLOR  LED0603_NOOUTLINE  [CHIPLED_0603_NOOUTLINE]
C4-22  COLOR  LED0603_NOOUTLINE  [CHIPLED_0603_NOOUTLINE]
C4-23  COLOR  LED0603_NOOUTLINE  [CHIPLED_0603_NOOUTLINE]
C4-24  COLOR  LED0603_NOOUTLINE  [CHIPLED_0603_NOOUTLINE]
C4-25  COLOR  LED0603_NOOUTLINE  [CHIPLED_0603_NOOUTLINE]
C4-26  COLOR  LED0603_NOOUTLINE  [CHIPLED_0603_NOOUTLINE]
C4-27  COLOR  LED0603_NOOUTLINE  [CHIPLED_0603_NOOUTLINE]
C4-28  COLOR  LED0603_NOOUTLINE  [CHIPLED_0603_NOOUTLINE]
C4-29  COLOR  LED0603_NOOUTLINE  [CHIPLED_0603_NOOUTLINE]
C4-30  COLOR  LED0603_NOOUTLINE  [CHIPLED_0603_NOOUTLINE]
C4-31  COLOR  LED0603_NOOUTLINE  [CHIPLED_0603_NOOUTLINE]
C4-32  COLOR  LED0603_NOOUTLINE  [CHIPLED_0603_NOOUTLINE]
C5-17  COLOR  LED0603_NOOUTLINE  [CHIPLED_0603_NOOUTLINE]
C5-18  COLOR  LED0603_NOOUTLINE  [CHIPLED_0603_NOOUTLINE]
C5-19  COLOR  LED0603_NOOUTLINE  [CHIPLED_0603_NOOUTLINE]
C5-20  COLOR  LED0603_NOOUTLINE  [CHIPLED_0603_NOOUTLINE]
C5-21  COLOR  LED0603_NOOUTLINE  [CHIPLED_0603_NOOUTLINE]
C5-22  COLOR  LED0603_NOOUTLINE  [CHIPLED_0603_NOOUTLINE]
C5-23  COLOR  LED0603_NOOUTLINE  [CHIPLED_0603_NOOUTLINE]
C5-24  COLOR  LED0603_NOOUTLINE  [CHIPLED_0603_NOOUTLINE]
C5-25  COLOR  LED0603_NOOUTLINE  [CHIPLED_0603_NOOUTLINE]
C5-26  COLOR  LED0603_NOOUTLINE  [CHIPLED_0603_NOOUTLINE]
C5-27  COLOR  LED0603_NOOUTLINE  [CHIPLED_0603_NOOUTLINE]
C5-28  COLOR  LED0603_NOOUTLINE  [CHIPLED_0603_NOOUTLINE]
C5-29  COLOR  LED0603_NOOUTLINE  [CHIPLED_0603_NOOUTLINE]
C5-30  COLOR  LED0603_NOOUTLINE  [CHIPLED_0603_NOOUTLINE]
C5-31  COLOR  LED0603_NOOUTLINE  [CHIPLED_0603_NOOUTLINE]
C5-32  COLOR  LED0603_NOOUTLINE  [CHIPLED_0603_NOOUTLINE]
C6-17  COLOR  LED0603_NOOUTLINE  [CHIPLED_0603_NOOUTLINE]
C6-18  COLOR  LED0603_NOOUTLINE  [CHIPLED_0603_NOOUTLINE]
C6-19  COLOR  LED0603_NOOUTLINE  [CHIPLED_0603_NOOUTLINE]
C6-20  COLOR  LED0603_NOOUTLINE  [CHIPLED_0603_NOOUTLINE]
C6-21  COLOR  LED0603_NOOUTLINE  [CHIPLED_0603_NOOUTLINE]
C6-22  COLOR  LED0603_NOOUTLINE  [CHIPLED_0603_NOOUTLINE]
C6-23  COLOR  LED0603_NOOUTLINE  [CHIPLED_0603_NOOUTLINE]
C6-24  COLOR  LED0603_NOOUTLINE  [CHIPLED_0603_NOOUTLINE]
C6-25  COLOR  LED0603_NOOUTLINE  [CHIPLED_0603_NOOUTLINE]
C6-26  COLOR  LED0603_NOOUTLINE  [CHIPLED_0603_NOOUTLINE]
C6-27  COLOR  LED0603_NOOUTLINE  [CHIPLED_0603_NOOUTLINE]
C6-28  COLOR  LED0603_NOOUTLINE  [CHIPLED_0603_NOOUTLINE]
C6-29  COLOR  LED0603_NOOUTLINE  [CHIPLED_0603_NOOUTLINE]
C6-30  COLOR  LED0603_NOOUTLINE  [CHIPLED_0603_NOOUTLINE]
C6-31  COLOR  LED0603_NOOUTLINE  [CHIPLED_0603_NOOUTLINE]
C6-32  COLOR  LED0603_NOOUTLINE  [CHIPLED_0603_NOOUTLINE]
C7-17  COLOR  LED0603_NOOUTLINE  [CHIPLED_0603_NOOUTLINE]
C7-18  COLOR  LED0603_NOOUTLINE  [CHIPLED_0603_NOOUTLINE]
C7-19  COLOR  LED0603_NOOUTLINE  [CHIPLED_0603_NOOUTLINE]
C7-20  COLOR  LED0603_NOOUTLINE  [CHIPLED_0603_NOOUTLINE]
C7-21  COLOR  LED0603_NOOUTLINE  [CHIPLED_0603_NOOUTLINE]
C7-22  COLOR  LED0603_NOOUTLINE  [CHIPLED_0603_NOOUTLINE]
C7-23  COLOR  LED0603_NOOUTLINE  [CHIPLED_0603_NOOUTLINE]
C7-24  COLOR  LED0603_NOOUTLINE  [CHIPLED_0603_NOOUTLINE]
C7-25  COLOR  LED0603_NOOUTLINE  [CHIPLED_0603_NOOUTLINE]
C7-26  COLOR  LED0603_NOOUTLINE  [CHIPLED_0603_NOOUTLINE]
C7-27  COLOR  LED0603_NOOUTLINE  [CHIPLED_0603_NOOUTLINE]
C7-28  COLOR  LED0603_NOOUTLINE  [CHIPLED_0603_NOOUTLINE]
C7-29  COLOR  LED0603_NOOUTLINE  [CHIPLED_0603_NOOUTLINE]
C7-30  COLOR  LED0603_NOOUTLINE  [CHIPLED_0603_NOOUTLINE]
C7-31  COLOR  LED0603_NOOUTLINE  [CHIPLED_0603_NOOUTLINE]
C7-32  COLOR  LED0603_NOOUTLINE  [CHIPLED_0603_NOOUTLINE]
C8-17  COLOR  LED0603_NOOUTLINE  [CHIPLED_0603_NOOUTLINE]
C8-18  COLOR  LED0603_NOOUTLINE  [CHIPLED_0603_NOOUTLINE]
C8-19  COLOR  LED0603_NOOUTLINE  [CHIPLED_0603_NOOUTLINE]
C8-20  COLOR  LED0603_NOOUTLINE  [CHIPLED_0603_NOOUTLINE]
C8-21  COLOR  LED0603_NOOUTLINE  [CHIPLED_0603_NOOUTLINE]
C8-22  COLOR  LED0603_NOOUTLINE  [CHIPLED_0603_NOOUTLINE]
C8-23  COLOR  LED0603_NOOUTLINE  [CHIPLED_0603_NOOUTLINE]
C8-24  COLOR  LED0603_NOOUTLINE  [CHIPLED_0603_NOOUTLINE]
C8-25  COLOR  LED0603_NOOUTLINE  [CHIPLED_0603_NOOUTLINE]
C8-26  COLOR  LED0603_NOOUTLINE  [CHIPLED_0603_NOOUTLINE]
C8-27  COLOR  LED0603_NOOUTLINE  [CHIPLED_0603_NOOUTLINE]
C8-28  COLOR  LED0603_NOOUTLINE  [CHIPLED_0603_NOOUTLINE]
C8-29  COLOR  LED0603_NOOUTLINE  [CHIPLED_0603_NOOUTLINE]
C8-30  COLOR  LED0603_NOOUTLINE  [CHIPLED_0603_NOOUTLINE]
C8-31  COLOR  LED0603_NOOUTLINE  [CHIPLED_0603_NOOUTLINE]
C8-32  COLOR  LED0603_NOOUTLINE  [CHIPLED_0603_NOOUTLINE]
C9-17  COLOR  LED0603_NOOUTLINE  [CHIPLED_0603_NOOUTLINE]
C9-18  COLOR  LED0603_NOOUTLINE  [CHIPLED_0603_NOOUTLINE]
C9-19  COLOR  LED0603_NOOUTLINE  [CHIPLED_0603_NOOUTLINE]
C9-20  COLOR  LED0603_NOOUTLINE  [CHIPLED_0603_NOOUTLINE]
C9-21  COLOR  LED0603_NOOUTLINE  [CHIPLED_0603_NOOUTLINE]
C9-22  COLOR  LED0603_NOOUTLINE  [CHIPLED_0603_NOOUTLINE]
C9-23  COLOR  LED0603_NOOUTLINE  [CHIPLED_0603_NOOUTLINE]
C9-24  COLOR  LED0603_NOOUTLINE  [CHIPLED_0603_NOOUTLINE]
C9-25  COLOR  LED0603_NOOUTLINE  [CHIPLED_0603_NOOUTLINE]
C9-26  COLOR  LED0603_NOOUTLINE  [CHIPLED_0603_NOOUTLINE]
C9-27  COLOR  LED0603_NOOUTLINE  [CHIPLED_0603_NOOUTLINE]
C9-28  COLOR  LED0603_NOOUTLINE  [CHIPLED_0603_NOOUTLINE]
C9-29  COLOR  LED0603_NOOUTLINE  [CHIPLED_0603_NOOUTLINE]
C9-30  COLOR  LED0603_NOOUTLINE  [CHIPLED_0603_NOOUTLINE]
C9-31  COLOR  LED0603_NOOUTLINE  [CHIPLED_0603_NOOUTLINE]
C9-32  COLOR  LED0603_NOOUTLINE  [CHIPLED_0603_NOOUTLINE]

### Nets
CA1-2: C1-17.C C1-18.C C1-19.C C1-20.C C1-21.C C1-22.C C1-23.C C1-24.C C2-17.A C3-17.A C4-17.A C5-17.A C6-17.A C7-17.A C8-17.A C9-17.A ; also sheet 3
CA2-2: C1-17.A C2-17.C C2-18.C C2-19.C C2-20.C C2-21.C C2-22.C C2-23.C C2-24.C C3-18.A C4-18.A C5-18.A C6-18.A C7-18.A C8-18.A C9-18.A ; also sheet 3
CA3-2: C1-18.A C2-18.A C3-17.C C3-18.C C3-19.C C3-20.C C3-21.C C3-22.C C3-23.C C3-24.C C4-19.A C5-19.A C6-19.A C7-19.A C8-19.A C9-19.A ; also sheet 3
CA4-2: C1-19.A C2-19.A C3-19.A C4-17.C C4-18.C C4-19.C C4-20.C C4-21.C C4-22.C C4-23.C C4-24.C C5-20.A C6-20.A C7-20.A C8-20.A C9-20.A ; also sheet 3
CA5-2: C1-20.A C2-20.A C3-20.A C4-20.A C5-17.C C5-18.C C5-19.C C5-20.C C5-21.C C5-22.C C5-23.C C5-24.C C6-21.A C7-21.A C8-21.A C9-21.A ; also sheet 3
CA6-2: C1-21.A C2-21.A C3-21.A C4-21.A C5-21.A C6-17.C C6-18.C C6-19.C C6-20.C C6-21.C C6-22.C C6-23.C C6-24.C C7-22.A C8-22.A C9-22.A ; also sheet 3
CA7-2: C1-22.A C2-22.A C3-22.A C4-22.A C5-22.A C6-22.A C7-17.C C7-18.C C7-19.C C7-20.C C7-21.C C7-22.C C7-23.C C7-24.C C8-23.A C9-23.A ; also sheet 3
CA8-2: C1-23.A C2-23.A C3-23.A C4-23.A C5-23.A C6-23.A C7-23.A C8-17.C C8-18.C C8-19.C C8-20.C C8-21.C C8-22.C C8-23.C C8-24.C C9-24.A ; also sheet 3
CA9-2: C1-24.A C2-24.A C3-24.A C4-24.A C5-24.A C6-24.A C7-24.A C8-24.A C9-17.C C9-18.C C9-19.C C9-20.C C9-21.C C9-22.C C9-23.C C9-24.C ; also sheet 3
CB1-2: C1-25.C C1-26.C C1-27.C C1-28.C C1-29.C C1-30.C C1-31.C C1-32.C C2-25.A C3-25.A C4-25.A C5-25.A C6-25.A C7-25.A C8-25.A C9-25.A ; also sheet 3
CB2-2: C1-25.A C2-25.C C2-26.C C2-27.C C2-28.C C2-29.C C2-30.C C2-31.C C2-32.C C3-26.A C4-26.A C5-26.A C6-26.A C7-26.A C8-26.A C9-26.A ; also sheet 3
CB3-2: C1-26.A C2-26.A C3-25.C C3-26.C C3-27.C C3-28.C C3-29.C C3-30.C C3-31.C C3-32.C C4-27.A C5-27.A C6-27.A C7-27.A C8-27.A C9-27.A ; also sheet 3
CB4-2: C1-27.A C2-27.A C3-27.A C4-25.C C4-26.C C4-27.C C4-28.C C4-29.C C4-30.C C4-31.C C4-32.C C5-28.A C6-28.A C7-28.A C8-28.A C9-28.A ; also sheet 3
CB5-2: C1-28.A C2-28.A C3-28.A C4-28.A C5-25.C C5-26.C C5-27.C C5-28.C C5-29.C C5-30.C C5-31.C C5-32.C C6-29.A C7-29.A C8-29.A C9-29.A ; also sheet 3
CB6-2: C1-29.A C2-29.A C3-29.A C4-29.A C5-29.A C6-25.C C6-26.C C6-27.C C6-28.C C6-29.C C6-30.C C6-31.C C6-32.C C7-30.A C8-30.A C9-30.A ; also sheet 3
CB7-2: C1-30.A C2-30.A C3-30.A C4-30.A C5-30.A C6-30.A C7-25.C C7-26.C C7-27.C C7-28.C C7-29.C C7-30.C C7-31.C C7-32.C C8-31.A C9-31.A ; also sheet 3
CB8-2: C1-31.A C2-31.A C3-31.A C4-31.A C5-31.A C6-31.A C7-31.A C8-25.C C8-26.C C8-27.C C8-28.C C8-29.C C8-30.C C8-31.C C8-32.C C9-32.A ; also sheet 3
CB9-2: C1-32.A C2-32.A C3-32.A C4-32.A C5-32.A C6-32.A C7-32.A C8-32.A C9-25.C C9-26.C C9-27.C C9-28.C C9-29.C C9-30.C C9-31.C C9-32.C ; also sheet 3

### Notes on the sheet
- Matrix A
- Matrix B
- e-radionica.com

## Sheet 5 of 5: Microcontroller
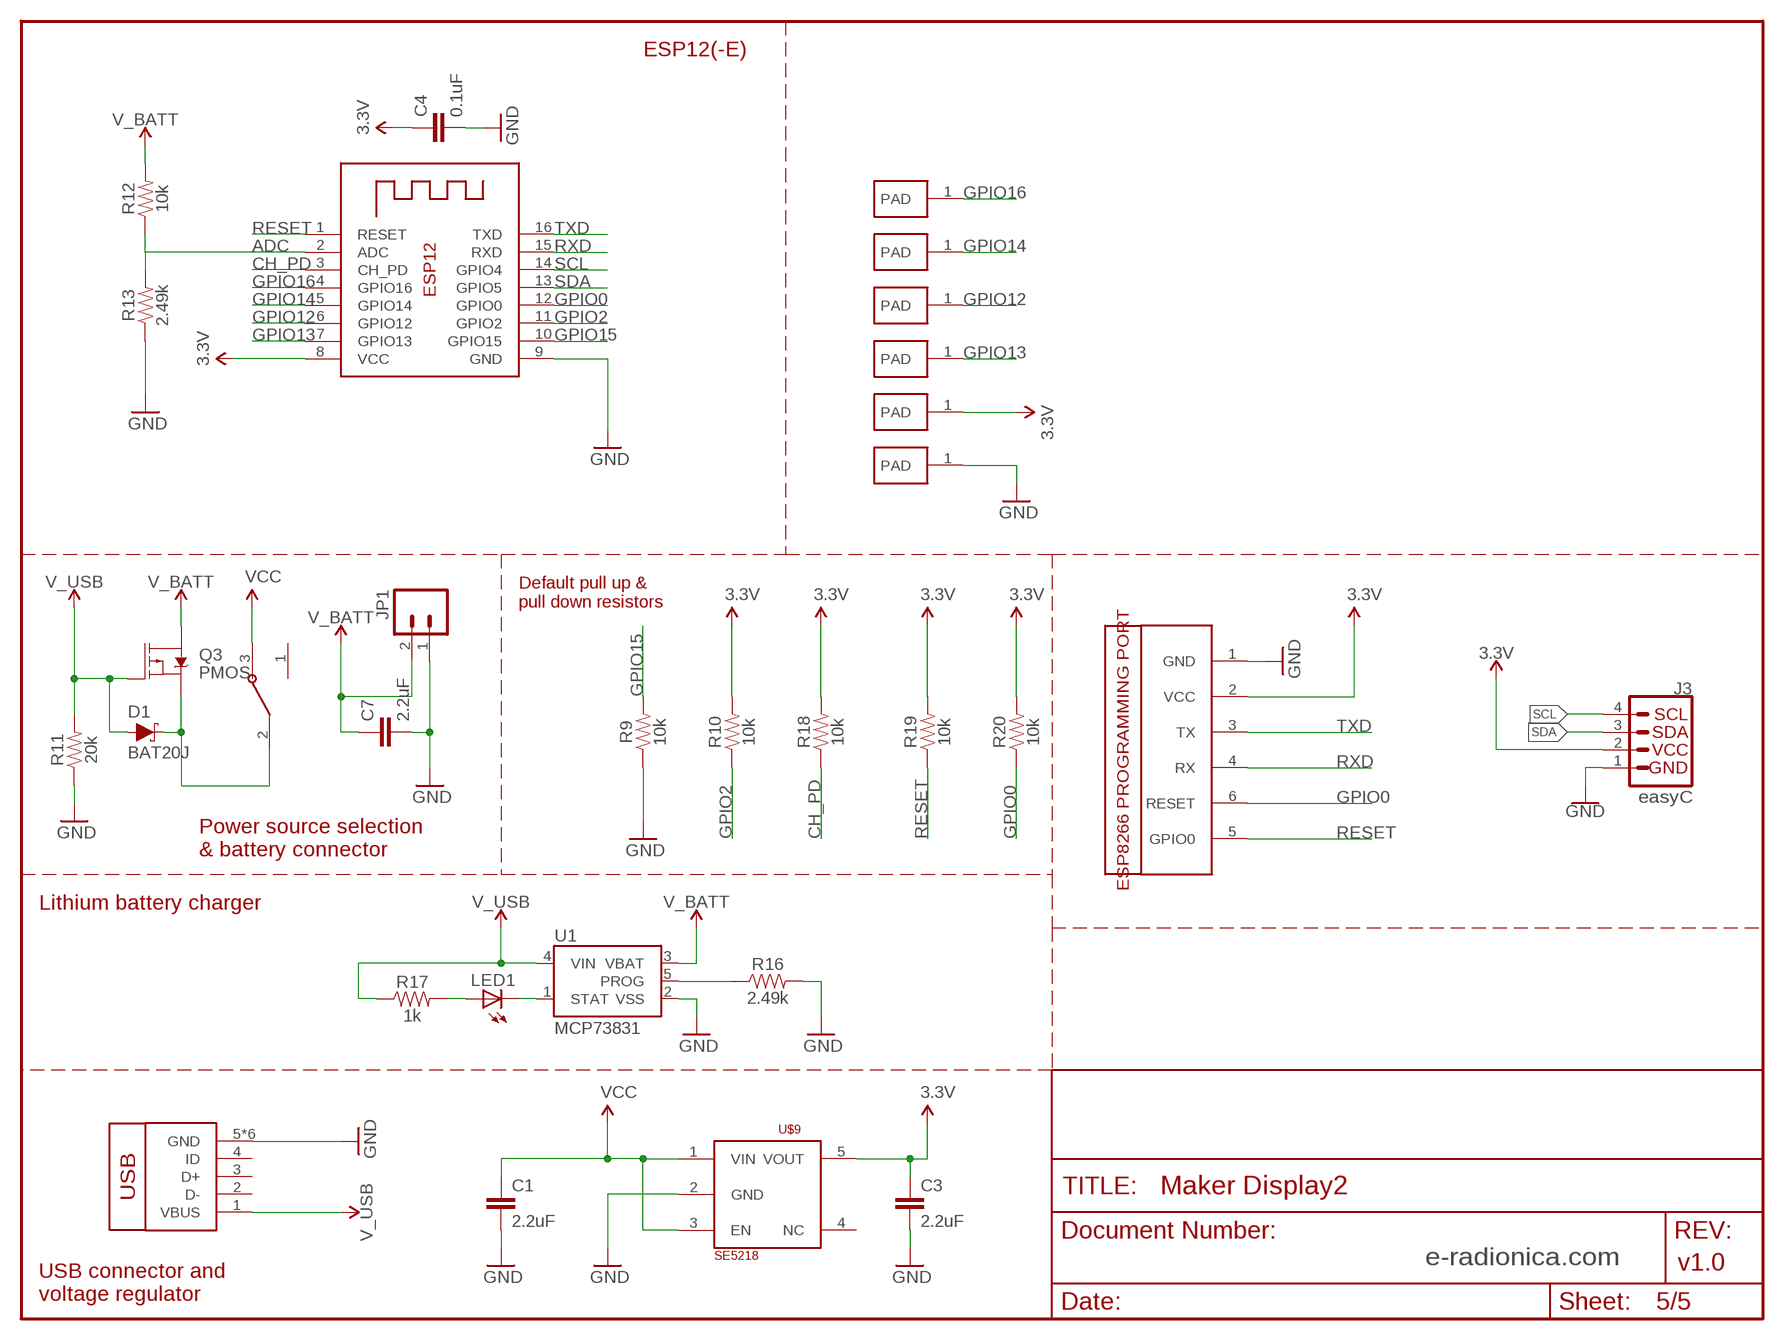
[diagram p4: schematic, sheet 5]

### Parts
C1  2.2uF  2.2UF-0603-10V-20%  [0603]
C3  2.2uF  2.2UF-0603-10V-20%  [0603]
C4  0.1uF  0.1UF-0603-25V-(+80/-20%)  [0603]
C7  2.2uF  2.2UF-0603-10V-20%  [0603]
D1  BAT20J  DIODE-SCHOTTKY-BAT20J  [SOD-323]
J3  QWIIC_CONNECTORJS-1MM  [1X04_1MM_RA]
JP1  M02-JST-2MM-SMT  [JST-2-SMD]
LED1  LEDCHIPLED_0805  [CHIPLED_0805]
Q3  PMOS  MOSFET_PCH-DMG2307L  [SOT23-3]
R9  10k  10KOHM-0603-1/10W-1%  [0603]
R10  10k  10KOHM-0603-1/10W-1%  [0603]
R11  20k  20KOHM-0603-1/10W-1%  [0603]
R12  10k  10KOHM-0603-1/10W-1%  [0603]
R13  2.49k  2.49KOHM-0603-1/10W-1%  [0603]
R16  2.49k  2.49KOHM-0603-1/10W-1%  [0603]
R17  1k  1KOHM-0603-1/10W-1%  [0603]
R18  10k  10KOHM-0603-1/10W-1%  [0603]
R19  10k  10KOHM-0603-1/10W-1%  [0603]
R20  10k  10KOHM-0603-1/10W-1%  [0603]
S1  SWITCH_SK-12D02-VG5  [SK-12D02-VG5]
U1  MCP73831  [SOT23-5]
U$3  ESP-PROGRAMMINGPORT  [ESP-PROGRAMMING-PORT]
U$4  PAD-1  [PAD-1]
U$5  PAD-1  [PAD-1]
U$6  PAD-1  [PAD-1]
U$7  PAD-1  [PAD-1]
U$9  SE5218  [SOT23-5]
U$12  PAD-1  [PAD-1]
U$14  PAD-1  [PAD-1]
U$15  USB-MICRO  [U-F-M5DD-Y-L]
X1  ESP8266-12  ESP-12  [ESP-12]

### Nets
3.3V: C3.1 C4.1 J3.2 R10.2 R18.2 R19.2 R20.2 U$3.2(VCC) U$9.5(VOUT) U$12.1(PAD) X1.8(VCC)
ADC: R12.1 R13.2 X1.2(ADC)
CH_PD: R18.1 X1.3(CH_PD)
GND: C1.2 C3.2 C4.2 C7.2 J3.1 JP1.1 R9.1 R11.1 R13.1 R16.2 U1.2(VSS) U$3.1(GND) U$9.2(GND) U$14.1(PAD) U$15.5(GND) U$15.PAD(GND) U$15.SHIELD1(GND) U$15.SHIELD2(GND) U$15.SHIELD3(GND) U$15.SHIELD4(GND) X1.9(GND) ; also sheet 1,3
GPIO0: R20.1 U$3.6(RESET) X1.12(GPIO0)
GPIO2: R10.1 X1.11(GPIO2)
GPIO12: U$6.1(PAD) X1.6(GPIO12)
GPIO13: U$7.1(PAD) X1.7(GPIO13)
GPIO14: U$5.1(PAD) X1.5(GPIO14)
GPIO15: R9.2 X1.10(GPIO15)
GPIO16: U$4.1(PAD) X1.4(GPIO16)
N$3: D1.C Q3.2(S) S1.2
N$10: R16.1 U1.5(PROG)
N$14: LED1.C U1.1(STAT)
N$15: LED1.A R17.2
RESET: R19.1 U$3.5(GPIO0) X1.1(RESET)
RXD: U$3.4(RX) X1.15(RXD)
SCL: J3.4 X1.14(GPIO4) ; also sheet 1,3
SDA: J3.3 X1.13(GPIO5) ; also sheet 1,3
TXD: U$3.3(TX) X1.16(TXD)
V_BATT: C7.1 JP1.2 Q3.3(D) R12.2 U1.3(VBAT)
V_USB: D1.A Q3.1(G) R11.2 R17.1 U1.4(VIN) U$15.1(VBUS)
VCC: C1.1 S1.3 U$9.1(VIN) U$9.3(EN) ; also sheet 1,3
Unconnected: S1.1 U$9.4(NC) U$15.2(D-) U$15.3(D+) U$15.4(ID)

### Notes on the sheet
- ESP12(-E)
- Default pull up &
  pull down resistors
- easyC
- Power source selection
  & battery connector
- Lithium battery charger
- e-radionica.com | v1.0
- USB connector and 
  voltage regulator

## Library data of the parts
C1 C3 C7 = SparkFun-Capacitors:2.2UF: 2.2µF ceramic capacitors A capacitor is a passive two-terminal electrical component used to store electrical energy temporarily in an electric field.; PROD_ID: CAP-07888
C1-1-C1-32 C2-1-C2-32 C3-1-C3-32 C4-1-C4-32 C5-1-C5-32 C6-1-C6-32 C7-1-C7-32 C8-1-C8-32 C9-1-C9-32 = microbuilder:LED: LED
C2 C4 C5 C10 C12 = SparkFun-Capacitors:0.1UF: 0.1µF ceramic capacitors A capacitor is a passive two-terminal electrical component used to store electrical energy temporarily in an electric field.; PROD_ID: CAP-00810
C6 C111 = SparkFun-Capacitors:10UF: 10.0µF ceramic capacitors A capacitor is a passive two-terminal electrical component used to store electrical energy temporarily in an electric field.; PROD_ID: CAP-10057
D1 = SparkFun-DiscreteSemi:DIODE-SCHOTTKY: Schottky diode A Schottky diode is a semiconductor diode which has a low forward voltage drop and a very fast switching action.; PROD_ID: DIO-11623; VALUE: 1A/23V/620mV
J3 = SparkFun-Connectors:QWIIC_CONNECTOR: SparkFun I2C Standard Qwiic Connector An SMD 1mm pitch JST connector makes it easy and quick (get it? Qwiic?) to connect I2C devices to each other. The Qwiic system <http://www.sparkfun.com/qwiic> enables fast and solderless connection between popular platforms and various sensors and actuators. We carry 200mm <https://www.sparkfun.com/products/14204>, 100mm <https://www.sparkfun.com/products/14205>, 50mm <https://www.sparkfun.com/products/14206>, and breadboard friendly <https://www.sparkfun.com/products/14207> Qwiic cables. We also offer 10 pcs strips <https://www.sparkfun.com/products/14323> the SMD connectors.; PROD_ID: CONN-13694
JP1 = SparkFun:M02: Header 2 Standard 2-pin 0.1" header. Use with straight break away headers (SKU : PRT-00116), right angle break away headers (PRT-00553), swiss pins (PRT-00743), machine pins (PRT-00117), and female headers (PRT-00115). Molex polarized connector foot print use with SKU : PRT-08233 with associated crimp pins and housings.
JP2-JP4 = SparkFun:FIDUCIAL: Fiducial Alignment Points Various fiducial points for machine vision alignment.
LED1 = adafruit:LED: LED
Q3 = SparkFun-DiscreteSemi:MOSFET_PCH: P-channel MOSFETs Voltage controlled devices that allow control of high current outputs. SparkFun Products: SparkFun ESP32 Thing <https://www.sparkfun.com/products/13907> SparkFun ESP8266 Thing <https://www.sparkfun.com/products/13231>; PROD_ID: TRANS-11308; VALUE: 2.5A/30V/105mΩ
R1-R3 R6-R8 R11 R14 = SparkFun-Resistors:20KOHM: 20kΩ resistor A resistor is a passive two-terminal electrical component that implements electrical resistance as a circuit element. Resistors act to reduce current flow, and, at the same time, act to lower voltage levels within circuits. - Wikipedia; PROD_ID: RES-09383
R4 R5 = SparkFun-Resistors:4.7KOHM: 4.7kΩ resistor A resistor is a passive two-terminal electrical component that implements electrical resistance as a circuit element. Resistors act to reduce current flow, and, at the same time, act to lower voltage levels within circuits. - Wikipedia; PROD_ID: RES-07857
R9 R10 R12 R18-R20 = SparkFun-Resistors:10KOHM: 10kΩ resistor A resistor is a passive two-terminal electrical component that implements electrical resistance as a circuit element. Resistors act to reduce current flow, and, at the same time, act to lower voltage levels within circuits. - Wikipedia; PROD_ID: RES-00824
R13 R16 = SparkFun-Resistors:2.49KOHM: 2.49kΩ resistor A resistor is a passive two-terminal electrical component that implements electrical resistance as a circuit element. Resistors act to reduce current flow, and, at the same time, act to lower voltage levels within circuits. - Wikipedia; PROD_ID: RES-09568
R17 = SparkFun-Resistors:1KOHM: 1kΩ resistor A resistor is a passive two-terminal electrical component that implements electrical resistance as a circuit element. Resistors act to reduce current flow, and, at the same time, act to lower voltage levels within circuits. - Wikipedia; PROD_ID: RES-07856
S1 = ERADIONICA_2:SWITCH_SK-12D02-VG5
U1 = SparkFun:MCP73831: Microchip's MCP73831 Miniature single cell, fully integrated Li-Ion, Li-polymer charge management controller http://ww1.microchip.com/downloads/en/DeviceDoc/21984a.pdf
U2 U4 = ERADIONICA_2:IS31FL3731: The IS31FL3731 is a compact LED driver for 144 single LEDs. The device can be programmed via an I2C compatible interface. The IS31FL3731 offers two blocks each driving 72 LEDs with 1/9 cycle rate. The required lines to drive all 144 LEDs are reduced to 18 by using the cross-plexing feature optimizing space on the PCB.
U$3 = ERADIONICA:ESP-PROGRAMMINGPORT
U$4-U$7 U$12 U$14 = ERADIONICA:PAD-1
U$9 = ERADIONICA:SE5218
U$15 = ERADIONICA:USB-MICRO
X1 = adafruit:ESP-12